# Altium schematic sheet connector-top-j3-1.SchDoc: Connector - J3(Top) 1
size Letter; CompanyName: Brinton Engineering, LLC; Address1: 3479 Edison Way; Address2: Menlo Park CA 94025; Address3: +1 (877) 778-8435; Address4: brintonengineering.com; Revision: 1; SheetNumber: 1; SheetTotal: 1
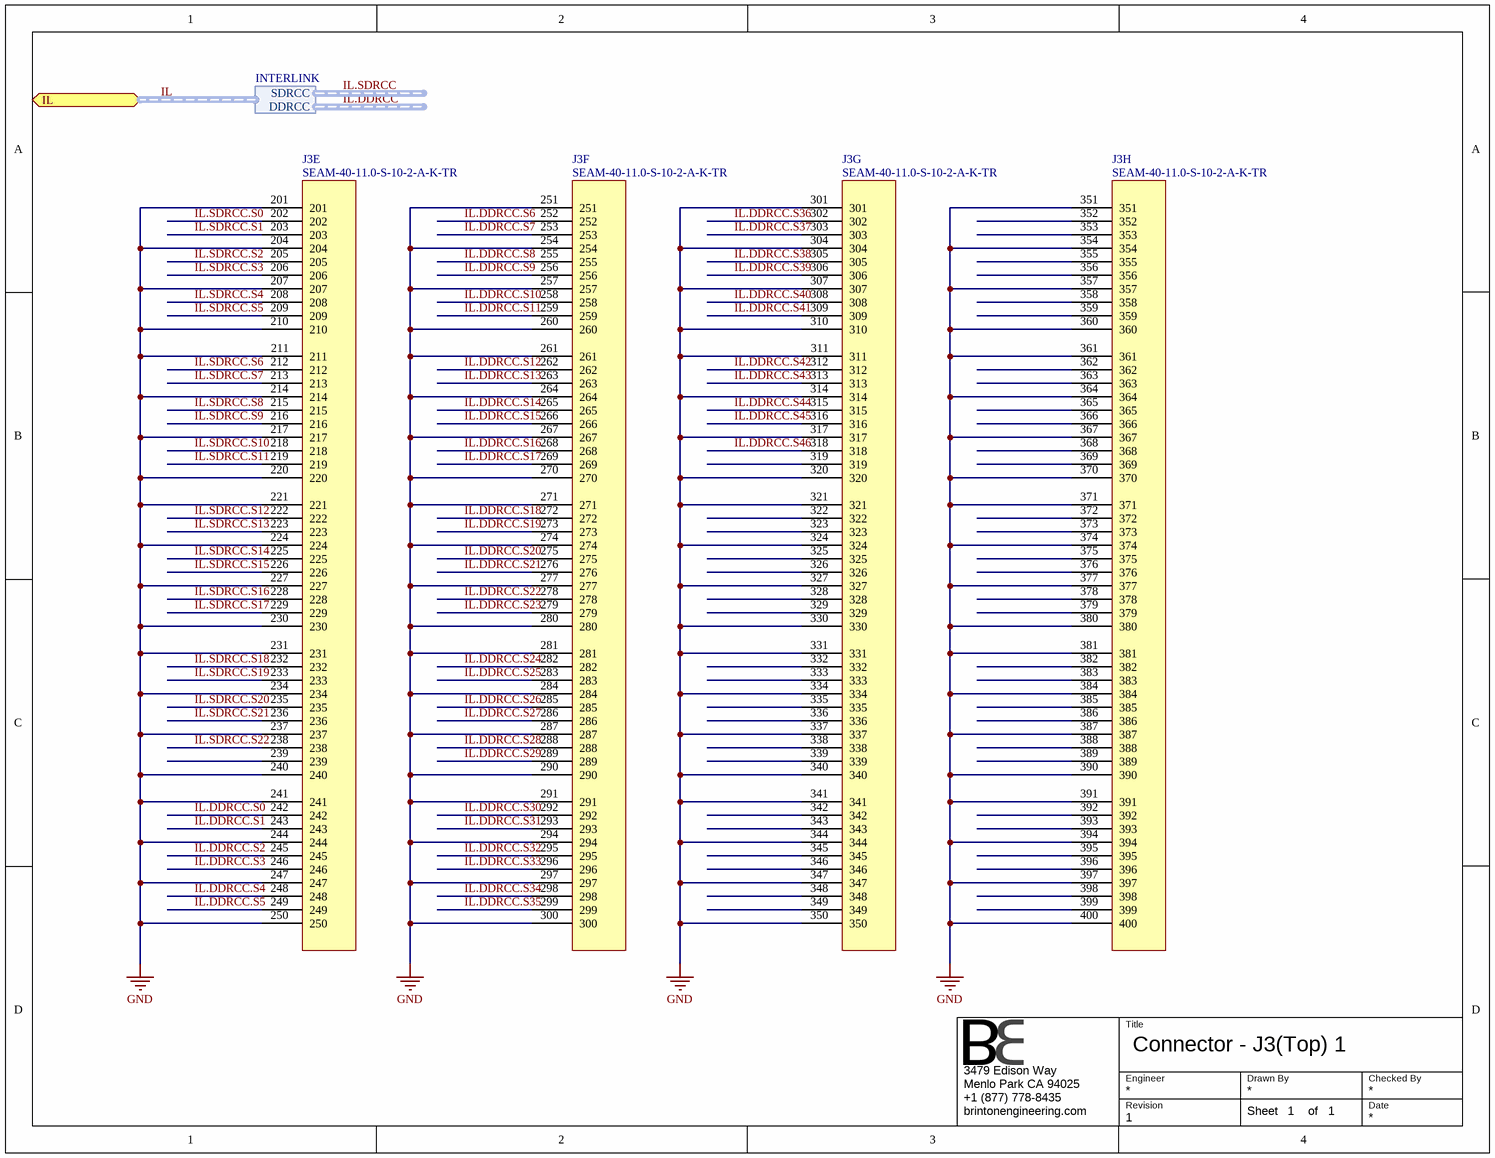
[diagram p0: connector-top-j3-1.SchDoc]

## Parts
J3  SEAM-40-11.0-S-10-2-A-K-TR  [SEAM-40-11.0-S-10-2-A-K-TR]  (parts E,F,G,H of 8)

## Ports
IL (harness INTERLINK)

## Harnesses
INTERLINK: DDRCC, SDRCC

## Nets
GND: J3.201 J3.204 J3.207 J3.210 J3.211 J3.214 J3.217 J3.220 J3.221 J3.224 J3.227 J3.230 J3.231 J3.234 J3.237 J3.240 J3.241 J3.244 J3.247 J3.250 J3.251 J3.254 J3.257 J3.260 J3.261 J3.264 J3.267 J3.270 J3.271 J3.274 J3.277 J3.280 J3.281 J3.284 J3.287 J3.290 J3.291 J3.294 J3.297 J3.300 J3.301 J3.304 J3.307 J3.310 J3.311 J3.314 J3.317 J3.320 J3.321 J3.324 J3.327 J3.330 J3.331 J3.334 J3.337 J3.340 J3.341 J3.344 J3.347 J3.350 J3.351 J3.354 J3.357 J3.360 J3.361 J3.364 J3.367 J3.370 J3.371 J3.374 J3.377 J3.380 J3.381 J3.384 J3.387 J3.390 J3.391 J3.394 J3.397 J3.400
IL.DDRCC.S0: J3.242
IL.DDRCC.S1: J3.243
IL.DDRCC.S2: J3.245
IL.DDRCC.S3: J3.246
IL.DDRCC.S4: J3.248
IL.DDRCC.S5: J3.249
IL.DDRCC.S6: J3.252
IL.DDRCC.S7: J3.253
IL.DDRCC.S8: J3.255
IL.DDRCC.S9: J3.256
IL.DDRCC.S10: J3.258
IL.DDRCC.S11: J3.259
IL.DDRCC.S12: J3.262
IL.DDRCC.S13: J3.263
IL.DDRCC.S14: J3.265
IL.DDRCC.S15: J3.266
IL.DDRCC.S16: J3.268
IL.DDRCC.S17: J3.269
IL.DDRCC.S18: J3.272
IL.DDRCC.S19: J3.273
IL.DDRCC.S20: J3.275
IL.DDRCC.S21: J3.276
IL.DDRCC.S22: J3.278
IL.DDRCC.S23: J3.279
IL.DDRCC.S24: J3.282
IL.DDRCC.S25: J3.283
IL.DDRCC.S26: J3.285
IL.DDRCC.S27: J3.286
IL.DDRCC.S28: J3.288
IL.DDRCC.S29: J3.289
IL.DDRCC.S30: J3.292
IL.DDRCC.S31: J3.293
IL.DDRCC.S32: J3.295
IL.DDRCC.S33: J3.296
IL.DDRCC.S34: J3.298
IL.DDRCC.S35: J3.299
IL.DDRCC.S36: J3.302
IL.DDRCC.S37: J3.303
IL.DDRCC.S38: J3.305
IL.DDRCC.S39: J3.306
IL.DDRCC.S40: J3.308
IL.DDRCC.S41: J3.309
IL.DDRCC.S42: J3.312
IL.DDRCC.S43: J3.313
IL.DDRCC.S44: J3.315
IL.DDRCC.S45: J3.316
IL.DDRCC.S46: J3.318
IL.SDRCC.S0: J3.202
IL.SDRCC.S1: J3.203
IL.SDRCC.S2: J3.205
IL.SDRCC.S3: J3.206
IL.SDRCC.S4: J3.208
IL.SDRCC.S5: J3.209
IL.SDRCC.S6: J3.212
IL.SDRCC.S7: J3.213
IL.SDRCC.S8: J3.215
IL.SDRCC.S9: J3.216
IL.SDRCC.S10: J3.218
IL.SDRCC.S11: J3.219
IL.SDRCC.S12: J3.222
IL.SDRCC.S13: J3.223
IL.SDRCC.S14: J3.225
IL.SDRCC.S15: J3.226
IL.SDRCC.S16: J3.228
IL.SDRCC.S17: J3.229
IL.SDRCC.S18: J3.232
IL.SDRCC.S19: J3.233
IL.SDRCC.S20: J3.235
IL.SDRCC.S21: J3.236
IL.SDRCC.S22: J3.238

Not connected (* = marked no-connect by the designer): J3 239 319 322 323 325 326 328 329 332 333 335 336 338 339 342 343 345 346 348 349 352 353 355 356 358 359 362 363 365 366 368 369 372 373 375 376 378 379 382 383 385 386 388 389 392 393 395 396 398 399

## Buses and harness runs
harness IL = port IL

## Notes on the sheet
- Title
- Engineer
- Revision
- Drawn By
- Checked By
- Date
- Sheet
- of

## Library data of the parts
J3 = SEAM-40-11.0-S-10-2-A-K-TR: Terminal Array Assembly, Surface Mount, 0.050" Pitch, 400 Pins; Manufacturer: Samtec; Manufacturer P/N: SEAM-40-11.0-S-10-2-A-K-TR